# Altium schematic sheet Dogfish3D - Power.SchDoc
size A
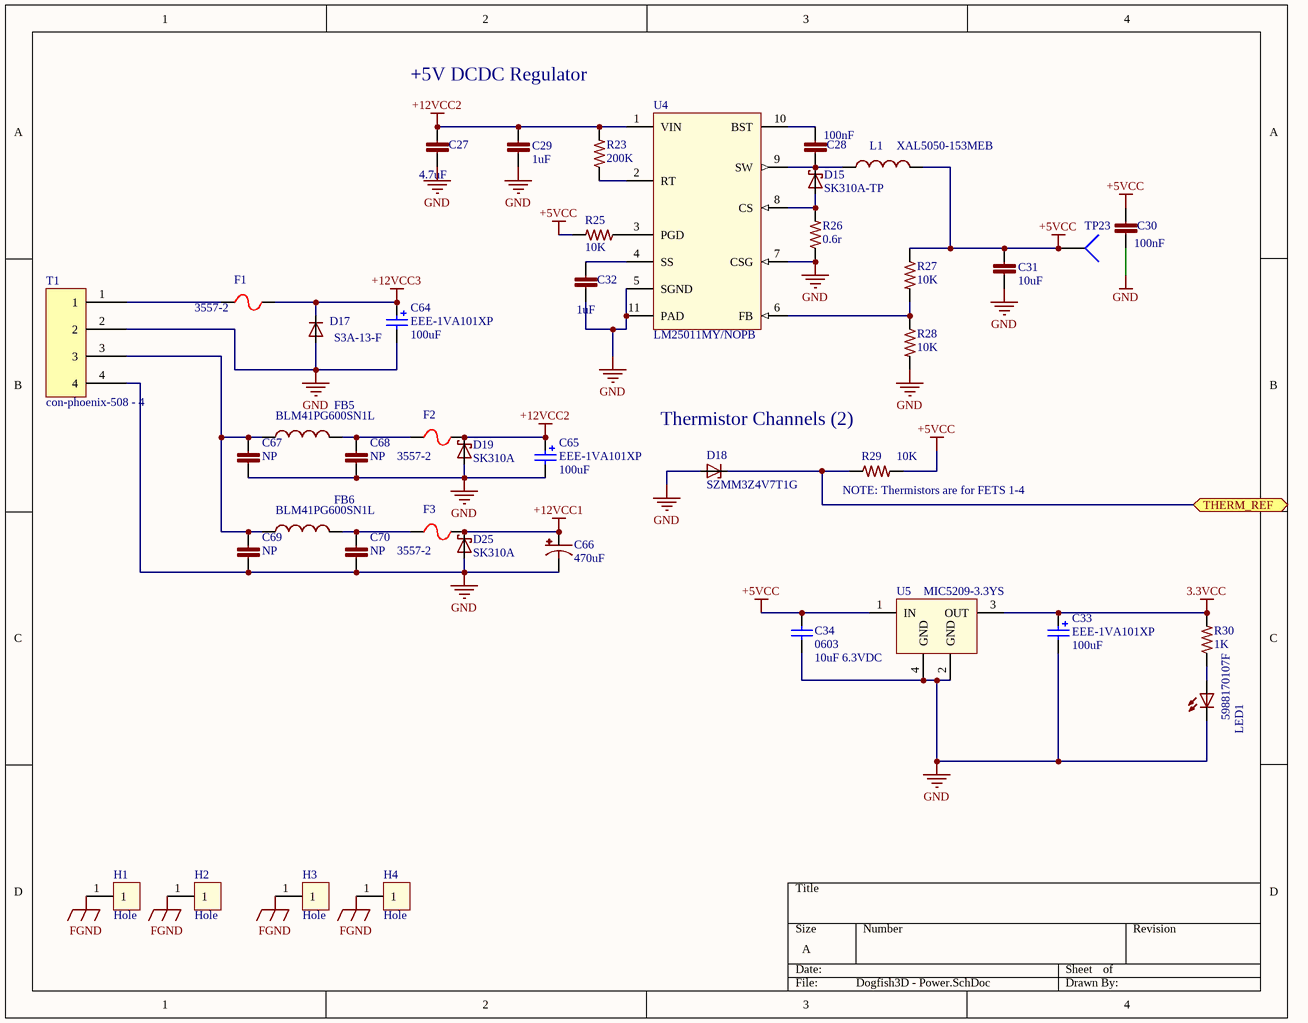
[diagram p0: Dogfish3D - Power.SchDoc]

## Parts
C27  4.7uF  [C1206]
C28  100nF  [C0603]
C29  1uF  [C0805]
C30  100nF  [C0603]
C31  10uF  [C0805]
C32  1uF  [C0402]
C33  EEE-1VA101XP  value 100uF  [EEE-1VA101XP]
C34  0603  value 10uF 6.3VDC  [C0603]
C64  EEE-1VA101XP  value 100uF  [EEE-1VA101XP]
C65  EEE-1VA101XP  value 100uF  [EEE-1VA101XP]
C66  470uF  [C12,5-5]
C67  NP  [C0603]
C68  NP  [C0603]
C69  NP  [C0603]
C70  NP  [C0603]
D15  SK310A-TP  [SMA-SM]
D17  S3A-13-F  [DO-214AB]
D18  SZMM3Z4V7T1G  [SOD323-R]
D19  SK310A  [SMA-SM]
D25  SK310A  [SMA-SM]
F1  3557-2  [3557]
F2  3557-2  [3557]
F3  3557-2  [3557]
FB5  BLM41PG600SN1L  [L1806]
FB6  BLM41PG600SN1L  [L1806]
H1  Hole  [Wave_hole_3x7-singleSided]  (no BOM)
H2  Hole  [Wave_hole_3x7-singleSided]  (no BOM)
H3  Hole  [Wave_hole_3x7-singleSided]  (no BOM)
H4  Hole  [Wave_hole_3x7-singleSided]  (no BOM)
L1  XAL5050-153MEB  [XAL50xx-153]
LED1  5988170107F  [LED2012120]
R23  200K  [R0402]
R25  10K  [R0603]
R26  0.6r  [2512R-0.55]
R27  10K  [R0603]
R28  10K  [R0603]
R29  10K  [R0603]
R30  1K  [R0603]
T1  con-phoenix-508 - 4  [MSTBV4]
TP23  TP4  [TP-2]  (value not drawn)
U4  LM25011MY/NOPB  [VSSOP10]
U5  MIC5209-3.3YS  [SOT230P700X190-4N]

## Ports
THERM_REF

## Nets
3.3VCC: C33.1 R30.2 U5.3(OUT)
+5VCC: C30.1 C31.1 C34.2 L1.2 R25.2 R27.1 R29.2 TP23.1 U5.1(IN)
+12VCC1: C66.1(+) D25.C F3.2
+12VCC2: C27.1 C29.1 C65.1 D19.C F2.2 R23.2 U4.1(VIN)
+12VCC3: C64.1 D17.C F1.2
FGND: H1.1 H2.1 H3.1 H4.1
GND: C27.2 C29.2 C30.2 C31.2 C32.2 C33.2 C34.1 C64.2 C65.2 C66.2(-) C67.2 C68.2 C69.2 C70.2 D17.A D18.A D19.A D25.A LED1.C R26.1 R28.2 T1.2 T1.4 U4.5(SGND) U4.7(CSG) U4.11(PAD) U5.2(GND) U5.4(GND)
THERM_REF: D18.C R29.1 ; port THERM_REF
NetC28_1: C28.1 U4.10(BST)
NetC28_2: C28.2 D15.C L1.1 U4.9(SW)
NetC32_1: C32.1 U4.4(SS)
NetC67_1: C67.1 C69.1 FB5.1 FB6.1 T1.3
NetC68_1: C68.1 F2.1 FB5.2
NetC70_1: C70.1 F3.1 FB6.2
NetD15_A: D15.A R26.2 U4.8(CS)
NetF1_1: F1.1 T1.1
NetLED1_A: LED1.A R30.1
NetR23_1: R23.1 U4.2(RT)
NetR25_1: R25.1 U4.3(PGD)
NetR27_2: R27.2 R28.1 U4.6(FB)

## Notes on the sheet
- +5V DCDC Regulator
- Thermistor Channels (2)
- (near R29) NOTE: Thermistors are for FETS 1-4

## Library data of the parts
C27 = C1206C475K5PACTU: CAP CER 1206 4.7uF 50V 10% X5R; LastRevisionNote: ImportComponents; Published: 23-Apr-2014; Publisher: UltiMachine; LastRevisionDate: 23-Apr-2014; ManufacturerPartNumber: C1206C475K5PACTU; VALUE: 4.7uF
C28 C30 C67-C70 = C0603C104K5RACTU: CAP CER 0603 100nF 50V 10% X7R; LastRevisionNote: ImportComponents; Published: 23-Apr-2014; Publisher: UltiMachine; LastRevisionDate: 23-Apr-2014; ManufacturerPartNumber: C0603C104K5RACTU
  C28 C30: VALUE: 100nF
  C67-C70: VALUE: NP
C29 = GRM21BR71H105KA12L: CAP CER 0805 1uF 50V 10% X7R; LastRevisionNote: ImportComponents; Published: 23-Apr-2014; Publisher: UltiMachine; LastRevisionDate: 23-Apr-2014; ManufacturerPartNumber: GRM21BR71H105KA12L; VALUE: 1uF
C31 = C0805C106K8PACTU: CAP CER 0805 10uF 10V 10% X5R; LastRevisionNote: ImportComponents; Published: 23-Apr-2014; Publisher: UltiMachine; LastRevisionDate: 23-Apr-2014; ManufacturerPartNumber: C0805C106K8PACTU; VALUE: 10uF
C32 = GRM155R60J105KE19D: CAP CER 0402 1uF 6.3V 10% X5R; LastRevisionNote: ImportComponents; Published: 23-Apr-2014; Publisher: UltiMachine; LastRevisionDate: 23-Apr-2014; ManufacturerPartNumber: GRM155R60J105KE19D; VALUE: 1uF
C33 C64 C65 = EEE-1VA101XP: CAP ALUM 100UF 35V 20% SMD; Manufacture: Panasonic; Digikey Part #: PCE3951CT-ND; Price: $0.63; Mount Type: SMT Panasonic VS D Series; Status: Active; Height: 7.70mm; Datasheet: http://industrial.panasonic.com/www-cgi/jvcr13pz.cgi?E+PZ+3+ABA0002+EEE1VA101XP+7+WW; Manufacture Part #: EEE-1VA101XP
C34 = C1608JB0J106K080AB: CAP CER 10UF 6.3V 10% JB 0603; MFR: TDK; Voltage: 6.3VDC; Published: 10 - Dec - 2014; LatestRevisionDate: 10 - Dec - 2014; Component Type: Chip Capacitor; MFR Part #: C1608JB0J106K080AB; Part Description: CAP CER 10UF 6.3V 10% JB 0603; Mounting Type: SMT 0603; Datasheet: http://www.tdk.com/pdf/TDKMLCCCapRange.pdf; Height: 0.9mm; Tolerance: 10%; Digikey #: 445-11185-1-ND; PackageReference: 0402
C66 = UPW1H471MHD1TO: CAP ALU 470uF 50V 20%; LastRevisionNote: ImportComponents; Published: 23-Apr-2014; Publisher: UltiMachine; LastRevisionDate: 23-Apr-2014; ManufacturerPartNumber: UPW1H471MHD1TO; VALUE: 470uF
D15 D19 D25 = SK310A: DIODE Schottky 3A SMA; LastRevisionNote: ImportComponents; LastRevisionDate: 23-Apr-2014; ManufacturerPartNumber: SK310A; Published: 23-Apr-2014; Publisher: UltiMachine
D17 = S3A-13-F: DIODE DO-214AB; LastRevisionNote: ImportComponents; Published: 23-Apr-2014; Publisher: UltiMachine; LastRevisionDate: 23-Apr-2014; Value: S3A-13-F
D18 = SZMM3Z4V7T1G: Z-Diode; Manufacturer: Fairchild; LastRevisionNote: ImportComponents; Published: 23-Apr-2014; Publisher: UltiMachine; LastRevisionDate: 23-Apr-2014
F1-F3 = 3557-2: FUSE PTH ATO; LastRevisionNote: ImportComponents; Published: 23-Apr-2014; Publisher: UltiMachine; LastRevisionDate: 23-Apr-2014; ManufacturerPartNumber: 3557-2
FB5 FB6 = BLM41PG600SN1L: FERRITE BEAD 1806 60ohm; LastRevisionNote: ImportComponents; Published: 23-Apr-2014; Publisher: UltiMachine; LastRevisionDate: 23-Apr-2014; ManufacturerPartNumber: BLM41PG600SN1L
L1 = XAL5050-153MEB: IND 15uH 3.9A 20%; LastRevisionNote: ImportComponents; Published: 23-Apr-2014; Publisher: UltiMachine; LastRevisionDate: 23-Apr-2014; ManufacturerPartNumber: XAL5050-153MEB; Value: XAL5050-153MEB
LED1 = 5988170107F: LED 0805 Green; LastRevisionNote: ImportComponents; Published: 23-Apr-2014; Publisher: UltiMachine; LastRevisionDate: 23-Apr-2014; VALUE: 5988170107F
R23 = CRCW0402200KFKED: RES 0402 22r 63mW 1%; LastRevisionNote: ImportComponents; Published: 23-Apr-2014; Publisher: UltiMachine; LastRevisionDate: 23-Apr-2014; ManufacturerPartNumber: CRCW0402200KFKED; VALUE: 200K
R25 R27-R29 = ERJ-3EKF1002V: RES 0603 10K 100mW 1%; LastRevisionNote: ImportComponents; Published: 23-Apr-2014; Publisher: UltiMachine; LastRevisionDate: 23-Apr-2014; ManufacturerPartNumber: ERJ-3EKF1002V; VALUE: 10K
R26 = RL2512FK-070R06L: RES 0.06 OHM 1W 1% 2512 SMD; LastRevisionNote: ImportComponents; Published: 23-Apr-2014; Publisher: UltiMachine; LastRevisionDate: 23-Apr-2014; ManufacturerPartNumber: RL2512FK-070R06L; VALUE: 0.6r
R30 = ERJ-3EKF1001V: RES 0603 1K 100mW 1%; LastRevisionNote: ImportComponents; Published: 23-Apr-2014; Publisher: UltiMachine; LastRevisionDate: 23-Apr-2014; ManufacturerPartNumber: ERJ-3EKF1001V; VALUE: 1K
T1 = con-phoenix-508_4
TP23 = Socket: LatestRevisionDate: 17-Jul-2002; LatestRevisionNote: Re-released for DXP Platform.; Publisher: Altium Limited
U4 = LM25011: REG BUCK; Value: LM25011MY/NOPB